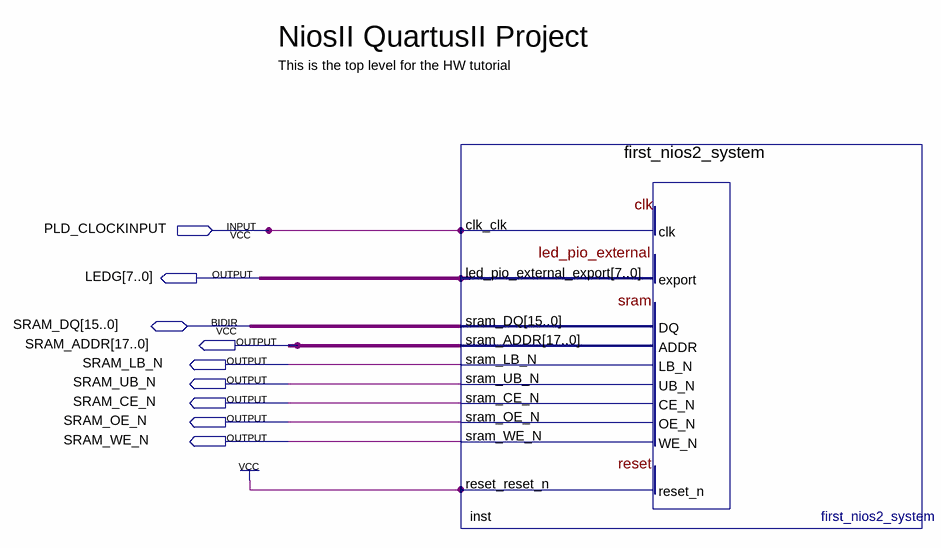
[diagram p0: schematic sheet]
// Quartus schematic nios2_quartus2_project.bdf as structural Verilog: 1 symbols, 9 pins
module nios2_quartus2_project (
  input  PLD_CLOCKINPUT,
  inout  [15:0] SRAM_DQ,
  output [7:0] LEDG,
  output [17:0] SRAM_ADDR,
  output SRAM_LB_N,
  output SRAM_UB_N,
  output SRAM_CE_N,
  output SRAM_OE_N,
  output SRAM_WE_N
);

  first_nios2_system inst (
    .clk_clk(PLD_CLOCKINPUT), .reset_reset_n(1'b1), .led_pio_external_export(LEDG), .sram_ADDR(SRAM_ADDR),
    .sram_LB_N(SRAM_LB_N), .sram_UB_N(SRAM_UB_N), .sram_CE_N(SRAM_CE_N), .sram_OE_N(SRAM_OE_N),
    .sram_WE_N(SRAM_WE_N), .sram_DQ(SRAM_DQ));

  // Notes on the sheet:
  //   NiosII QuartusII Project
  //   This is the top level for the HW tutorial
endmodule
